# Altium schematic sheet Power.SchDoc
size A4; SPICEModelCacheNZNTPRID: <root> / <DocumentId>NZNTPRID</DocumentId> / <CacheFrame Number="0"> / <Model Name="7345_7447773100_10u" Kind="CKT"> / <Text>******* / .subckt 7345_7447773100_10u 1 2 / Rp 1 2 9166 / Cp 1 2 4.545p / Rs 1 N3 0.0375 / L1 N3 2 10.406u / .ends 7345_7447773100_10u</Text> / </Model> / </CacheFrame> / </root>
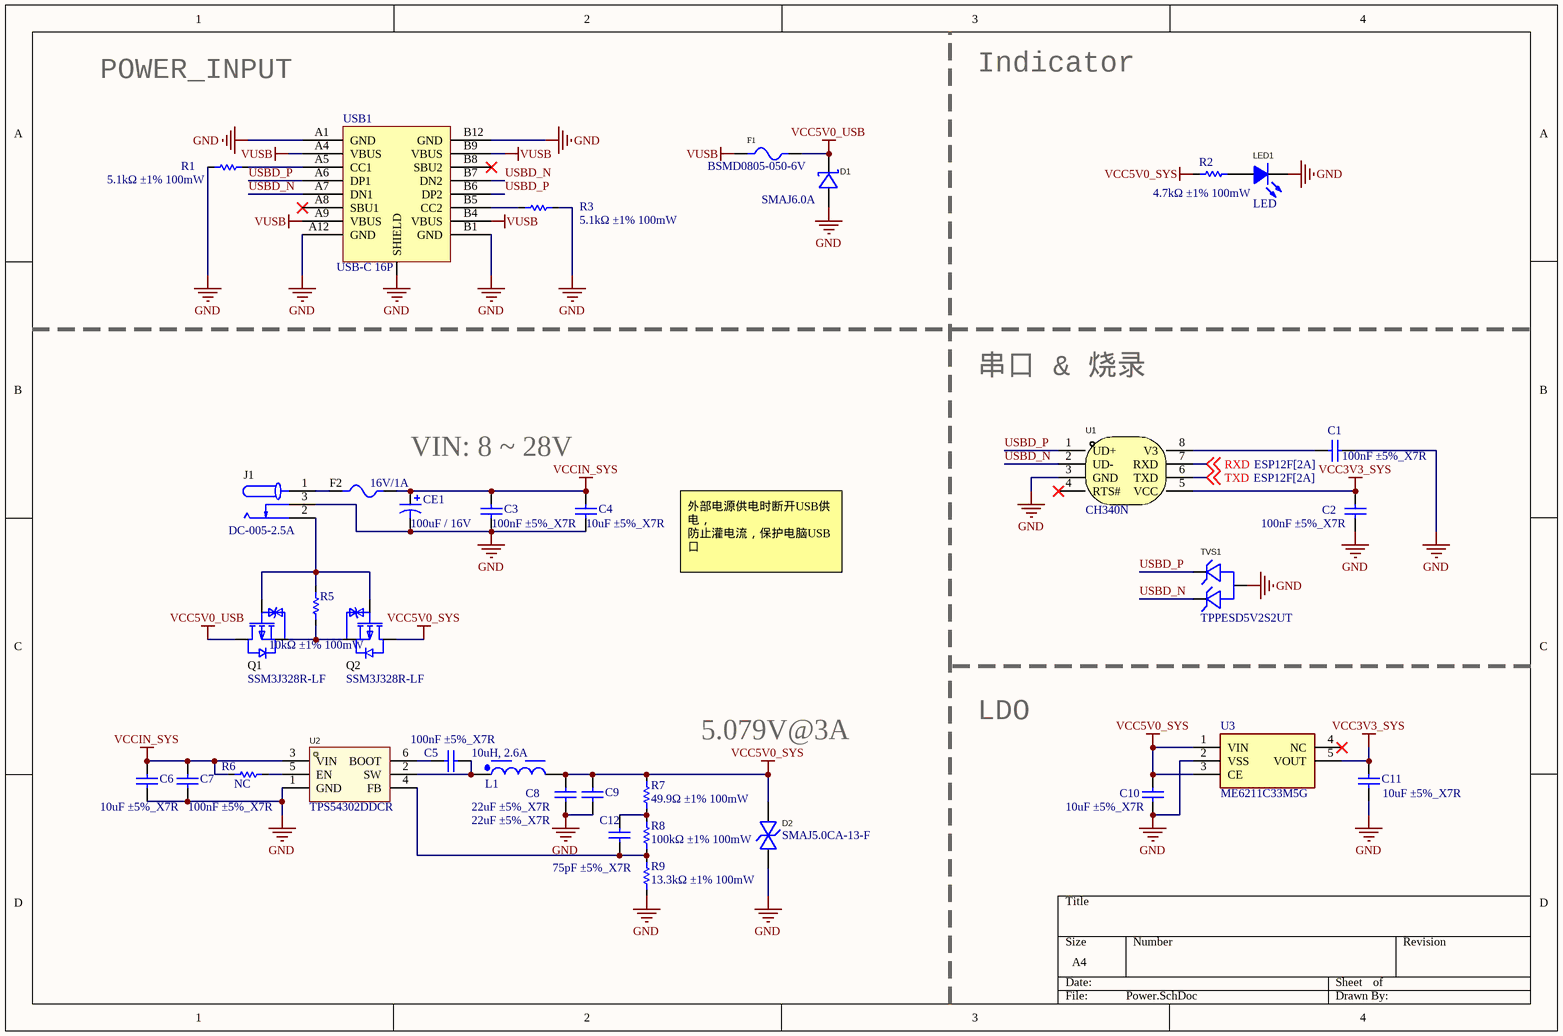
[diagram p0: Power.SchDoc]

## Parts
C1  100nF ±5%_X7R  [C0603]
C2  100nF ±5%_X7R  [C0603]
C3  100nF ±5%_X7R  [C0603]
C4  10uF ±5%_X7R  [C0603]
C5  100nF ±5%_X7R  [C0402]
C6  10uF ±5%_X7R  [C0603]
C7  100nF ±5%_X7R  [C0603]
C8  22uF ±5%_X7R  [C0603]
C9  22uF ±5%_X7R  [C0603]
C10  10uF ±5%_X7R  [C0603]
C11  10uF ±5%_X7R  [C0603]
C12  75pF ±5%_X7R  [C0402]
CE1  100uF / 16V  [CAP-SMD]
D1  SMAJ6.0A  [SMA_L4.4-W2.6-LS5.0-RD]
D2  SMAJ5.0CA-13-F  [SMA_L4.4-W2.6-LS5.0-BI]
F1  BSMD0805-050-6V  [F0805]
F2  16V/1A  [F1206]
J1  DC-005-2.5A  [CONN-TH_DC-005-2.5A-2.0]
L1  10uH, 2.6A  [WE-PD_7345P]
LED1  LED  [LED0603-RD]
Q1  SSM3J328R-LF  [SOT-23-3_L2.9-W1.4-P1.91-LS2.6-BR]
Q2  SSM3J328R-LF  [SOT-23-3_L2.9-W1.4-P1.91-LS2.6-BR]
R1  5.1kΩ ±1% 100mW  [R0402]
R2  4.7kΩ ±1% 100mW  [R0603]
R3  5.1kΩ ±1% 100mW  [R0402]
R5  10kΩ ±1% 100mW  [R0603]
R6  NC  [R0402]
R7  49.9Ω ±1% 100mW  [R0402]
R8  100kΩ ±1% 100mW  [R0402]
R9  13.3kΩ ±1% 100mW  [R0402]
TVS1  TPPESD5V2S2UT  [SOT-23-3_L2.9-W1.3-P1.90-LS2.4-BR]
U1  CH340N  [SOP-8_L4.9-W3.9-P1.27-LS6.0-BL]
U2  TPS54302DDCR  [SOT-23-6_L2.9-W1.6-P0.95-LS2.8-BL]
U3  ME6211C33M5G  [SOT95P282X145-5N]
USB1  USB-C 16P  [USB-C-16P]

## Nets
GND: C1.1 C2.1 C3.1 C4.1 C6.1 C7.1 C8.1 C9.1 C10.1 C11.1 CE1.2 D1.2(A) D2.1 J1.3 LED1.2(K) R1.1 R3.2 R9.1 TVS1.3(K) U1.3(GND) U2.1(GND) U3.2(VSS) USB1.0(SHIELD) USB1.A1(GND) USB1.A12(GND) USB1.B1(GND) USB1.B12(GND)
VCC3V3_SYS: C2.2 C11.2 U1.5(VCC) U3.5(VOUT)
VCC5V0_SYS: C8.2 C9.2 C10.2 D2.2 L1.2 Q2.3(D) R2.1 R7.2 U3.1(VIN) U3.3(CE)
VCC5V0_USB: D1.1(K) F1.2 Q1.3(D)
VCCIN_SYS: C3.2 C4.2 C6.2 C7.2 CE1.1 F2.2 R6.2 U2.3(VIN)
VUSB: F1.1 USB1.A4(VBUS) USB1.A9(VBUS) USB1.B4(VBUS) USB1.B9(VBUS)
RXD: U1.7(RXD) ; off-sheet RXD
TXD: U1.6(TXD) ; off-sheet TXD
USBD_N: TVS1.1(A) U1.2(UD-) USB1.A7(DN1) USB1.B7(DN2)
USBD_P: TVS1.2(A) U1.1(UD+) USB1.A6(DP1) USB1.B6(DP2)
NetC1_2: C1.2 U1.8(V3)
NetC5_1: C5.1 L1.1 U2.2(SW)
NetC5_2: C5.2 U2.6(BOOT)
NetC12_1: C12.1 R8.1 R9.2 U2.4(FB)
NetC12_2: C12.2 R7.1 R8.2
NetF2_1: F2.1 J1.1
NetJ1_2: J1.2 Q1.1(G) Q2.1(G) R5.1
NetLED1_1: LED1.1(A) R2.2
NetQ1_2: Q1.2(S) Q2.2(S) R5.2
NetR1_2: R1.2 USB1.A5(CC1)
NetR3_1: R3.1 USB1.B5(CC2)
NetR6_1: R6.1 U2.5(EN)

Not connected (* = marked no-connect by the designer): U1 4(RTS#)*; U3 4(NC)*; USB1 A8(SBU1)* B8(SBU2)*

## Notes on the sheet
- POWER_INPUT
- Indicator
- 串口 & 烧录
- VIN: 8 ~ 28V
- 外部电源供电时断开USB供电，
  防止灌电流，保护电脑USB口
- 5.079V@3A
- LDO

## Library data of the parts
C1-C12 = Cap: Capacitor; Published: 8-Jun-2000; LatestRevisionDate: 17-Jul-2002; LatestRevisionNote: Re-released for DXP Platform.; PackageReference: RAD-0.3; Publisher: Altium Limited; PackageDescription: Radial Cap, Thru-Hole; 2 Leads; 0.3 in Pin Spacing
CE1 = Cap Pol: Polarized Capacitor (Axial); Published: 8-Jun-2000; LatestRevisionDate: 17-Jul-2002; LatestRevisionNote: Re-released for DXP Platform.; PackageReference: POLAR0.8; Publisher: Altium Limited; PackageDescription: Polarized Capacitor; 2 Leads
D1 = SMAJ6.0A_C152112: Manufacturer: BORN(伯恩半导体); Add into BOM: yes; Polarity: 单向; Reverse Stand-Off Voltage (Vrwm): 6V; Breakdown Voltage: 6.67V; Peak Pulse Current (Ipp)@10/1000μs: 38.8A; Maximum Clamping Voltage: 10.3V; Name: SMAJ6.0A; Symbol: SMAJ6.0A_C152112; Device: SMAJ6.0A_C152112; LCSC Part Name: 单向 Vrwm:6V; Supplier Part: C152112; Manufacturer Part: SMAJ6.0A; Supplier Footprint: SMA(DO-214AC); JLCPCB Part Class: Extended Part; Datasheet: https://atta.szlcsc.com/upload/public/pdf/source/20180207/C152112_15179949389561359152.pdf; Supplier: LCSC; Convert to PCB: yes
D2 = SMAJ5.0CA: Manufacturer: DIODES(美台); Add into BOM: yes; Polarity: 双向; Reverse Stand-Off Voltage (Vrwm): 5V; Breakdown Voltage (Min): 6.4V; Breakdown Voltage (Max): 7.25V; Reverse Leakage Current (Ir): 800uA; Maximum Clamping Voltage: 9.2V; Peak Pulse Power Dissipation (Ppp)@10/1000μs: 400W; Name: SMAJ5.0CA-13-F; Symbol: SMAJ5.0CA-13-F; Device: SMAJ5.0CA-13-F; LCSC Part Name: 双向 Vrwm:5V 400W; Supplier Part: C134993; Manufacturer Part: SMAJ5.0CA-13-F; Supplier Footprint: SMA(DO-214AC); JLCPCB Part Class: Extended Part; Datasheet: https://atta.szlcsc.com/upload/public/pdf/source/20180308/C134993_15204896803081413896.pdf; Supplier: LCSC; Convert to PCB: yes; Peak Pulse Current (Ipp)@10/1000μs: -
F1 = BSMD0805-050-6V: Manufacturer: BHFUSE(佰宏); Add into BOM: yes; Operating Voltage (Max): 6V; Current Rating (Max): 40A; Hold Current: 500mA; Trip Current: 1A; Power Dissipation: 500mW; Resistance - Initial (Ri) (Min): 100mΩ; Resistance - Post Trip (R1) (Max): 850mΩ; Maximum Time to Trip: 100ms; Name: BSMD0805-050-6V; Symbol: BSMD0805-050-6V; Device: BSMD0805-050-6V; LCSC Part Name: 6V 500mA 0805自恢复; Supplier Part: C883108; Manufacturer Part: BSMD0805-050-6V; Supplier Footprint: 0805; JLCPCB Part Class: Extended Part; Datasheet: https://atta.szlcsc.com/upload/public/pdf/source/20220223/3FD8E8A8A3681642EAEF465E16495357.pdf; Supplier: LCSC; Convert to PCB: yes; Operating Temperature: -40℃~+85℃
F2 = FUSE: Manufacturer: BHFUSE(佰宏); Name: BSMD0805-050-6V; Add into BOM: yes; Operating Voltage (Max): 6V; Current Rating (Max): 40A; Hold Current: 500mA; Trip Current: 1A; Power Dissipation: 500mW; Resistance - Initial (Ri) (Min): 100mΩ; Resistance - Post Trip (R1) (Max): 850mΩ; Maximum Time to Trip: 100ms; Symbol: BSMD0805-050-6V; Device: BSMD0805-050-6V; LCSC Part Name: 6V 500mA 0805自恢复; Supplier Part: C883108; Manufacturer Part: BSMD0805-050-6V; Supplier Footprint: 0805; JLCPCB Part Class: Extended Part; Datasheet: https://atta.szlcsc.com/upload/public/pdf/source/20220223/3FD8E8A8A3681642EAEF465E16495357.pdf; Supplier: LCSC; Convert to PCB: yes; Operating Temperature: -40℃~+85℃
J1 = DC-005: Manufacturer: XKB Connectivity(中国星坤); Name: DC-005-2.5A-2.5; Add into BOM: yes; Connector Type: DC电源插座; Inside Contact Diameter: 2.5mm; Outside Contact Diameter: 6.2mm; Current Rating (Max): 2.5A; Voltage Rating (Max): 24V; Welding Temperature (Max): 260℃; Symbol: DC-005-2.5A-2.5; Device: DC-005-2.5A-2.5; LCSC Part Name: DC电源插座 内径:2.5mm 外径:6.2mm; Supplier Part: C319098; Manufacturer Part: DC-005-2.5A-2.5; Supplier Footprint: 插件; JLCPCB Part Class: Extended Part; Datasheet: https://atta.szlcsc.com/upload/public/pdf/source/20220901/6F9138B665EDB96A8FB5BCA403DC5722.pdf; Supplier: LCSC; Convert to PCB: yes; Contact Material: 黄铜; Operating Temperature Range: -20℃~+70℃
L1 = 7447773100: WE-PD SMT Power Inductor, size 7345P, 10uH, 2.6A, 45mOhm; Manufacturer: Wurth Elektronik; DC Resistance: 37.5mOhm; Saturation Current: 3.8A; Self Resonant Frequency: 23MHz; Type: Performance; Manufacturer Part Number: 7447773100; Category: Power Inductors; Match Code: WE-PD; ComponentLink1Description: Website Link; ComponentLink1URL: https://www.we-online.com/redexpert/article/7447773100?ad; ComponentLink2Description: Datasheet Link; ComponentLink2URL: https://www.we-online.com/redexpert/spec/7447773100?ad; Mount: Surface Mount; Operating Temperature Max: 150°C; Operating Temperature Min: -40°C; Packaging: Tape and Reel; Case/Size Code: 7345P; Length: 7.3mm; Width: 7.4mm; Height: 4.5mm; DC Resistance Max: 45mOhm; Inductance: 10uH; Rated Current: 2.6A
LED1 = LED: 发光颜色:; Manufacturer: EVERLIGHT(亿光); Name: 17-21SURC/S530-A2/TR8; Add into BOM: yes; Emitted Color: 红灯; Symbol: 17-21SURC/S530-A2/TR8; Device: 17-21SURC/S530-A2/TR8; LCSC Part Name: 红灯; Supplier Part: C131244; Manufacturer Part: 17-21SURC/S530-A2/TR8; Supplier Footprint: 0805; JLCPCB Part Class: Extended Part; Datasheet: https://atta.szlcsc.com/upload/public/pdf/source/20170918/C131244_1505726880590976254.pdf; Supplier: LCSC; Convert to PCB: yes
Q1 Q2 = MOSFET: Manufacturer: VBsemi(微碧); Name: SSM3J328R-VB; Add into BOM: yes; Symbol: SSM3J328R-VB; Device: SSM3J328R-VB; LCSC Part Name: SSM3J328R-VB; Supplier Part: C7494583; Manufacturer Part: SSM3J328R-VB; Supplier Footprint: SOT-23(TO-236); Datasheet: https://atta.szlcsc.com/upload/public/pdf/source/20230809/B11CEF1749BD8B4A43E8BE92C63E6317.pdf; Supplier: LCSC; Convert to PCB: yes
R1-R3 R5-R9 = Res: Resistor; Published: 8-Jun-2000; LatestRevisionDate: 17-Jul-2002; LatestRevisionNote: Re-released for DXP Platform.; PackageReference: AXIAL-0.3; Publisher: Altium Limited; PackageDescription: Axial Device, Thru-Hole; 2 Leads; 0.3 in Pin Spacing
TVS1 = TVS: Manufacturer: TECH PUBLIC(台舟); Add into BOM: yes; Name: TPPESD5V2S2UT; Symbol: TPPESD5V2S2UT; Device: TPPESD5V2S2UT; LCSC Part Name: TPPESD5V2S2UT; Supplier Part: C558449; Manufacturer Part: TPPESD5V2S2UT; Supplier Footprint: SOT-23; JLCPCB Part Class: Extended Part; Datasheet: https://atta.szlcsc.com/upload/public/pdf/source/20210810/D18798CDF2FA9545B0B94BB525A81819.pdf; Supplier: LCSC; Convert to PCB: yes
U1 = CH340N: Manufacturer: WCH(南京沁恒); Symbol: CH340N_C2977777; Add into BOM: yes; Name: CH340N; Device: CH340N; LCSC Part Name: USB转串口芯片 CH340; Supplier Part: C2977777; Manufacturer Part: CH340N; Supplier Footprint: SOP-8; JLCPCB Part Class: Extended Part; Datasheet: https://atta.szlcsc.com/upload/public/pdf/source/20220223/82A45E4FF89B3EDCAD50B354450A7EF4.pdf; Supplier: LCSC; Convert to PCB: yes
U2 = TPS54302DDCR: Manufacturer: TI(德州仪器); Symbol: TPS54302DDCR_C311983; Add into BOM: yes; Function: 降压型; Synchronous Rectification: 是; Output Type: 可调; Number of Outputs: 1; Topology: 降压式; Input Voltage: 4.5V~28V; Output Voltage: 596mV~28V; Output Current (Max): 3A; Switching Frequency: 400kHz; Name: TPS54302DDCR; Device: TPS54302DDCR; LCSC Part Name: 降压型 输入4.5V~28V 输出596mV~28V 3A; Supplier Part: C311983; Manufacturer Part: TPS54302DDCR; Supplier Footprint: TSOT-23-6; JLCPCB Part Class: Extended Part; Datasheet: https://atta.szlcsc.com/upload/public/pdf/source/20181023/C311983_0948EE70BFAD2011B492BD3F4CEA709D.pdf; Supplier: LCSC; Convert to PCB: yes; Operating Temperature: -40℃~+125℃@(TJ)
U3 = ME6211C33M5G: Integrated Circuit; Manufacturer_Name: Microne; Height: 1.45mm; Manufacturer_Part_Number: ME6211C33M5G